# Altium schematic sheet microcontroller.SchDoc
size A4; Date: 21 Jul 2025; CompanyName: Abdullah; Engineer: Abdullah; Revision: 2; SheetNumber: 3; SheetTotal: 4
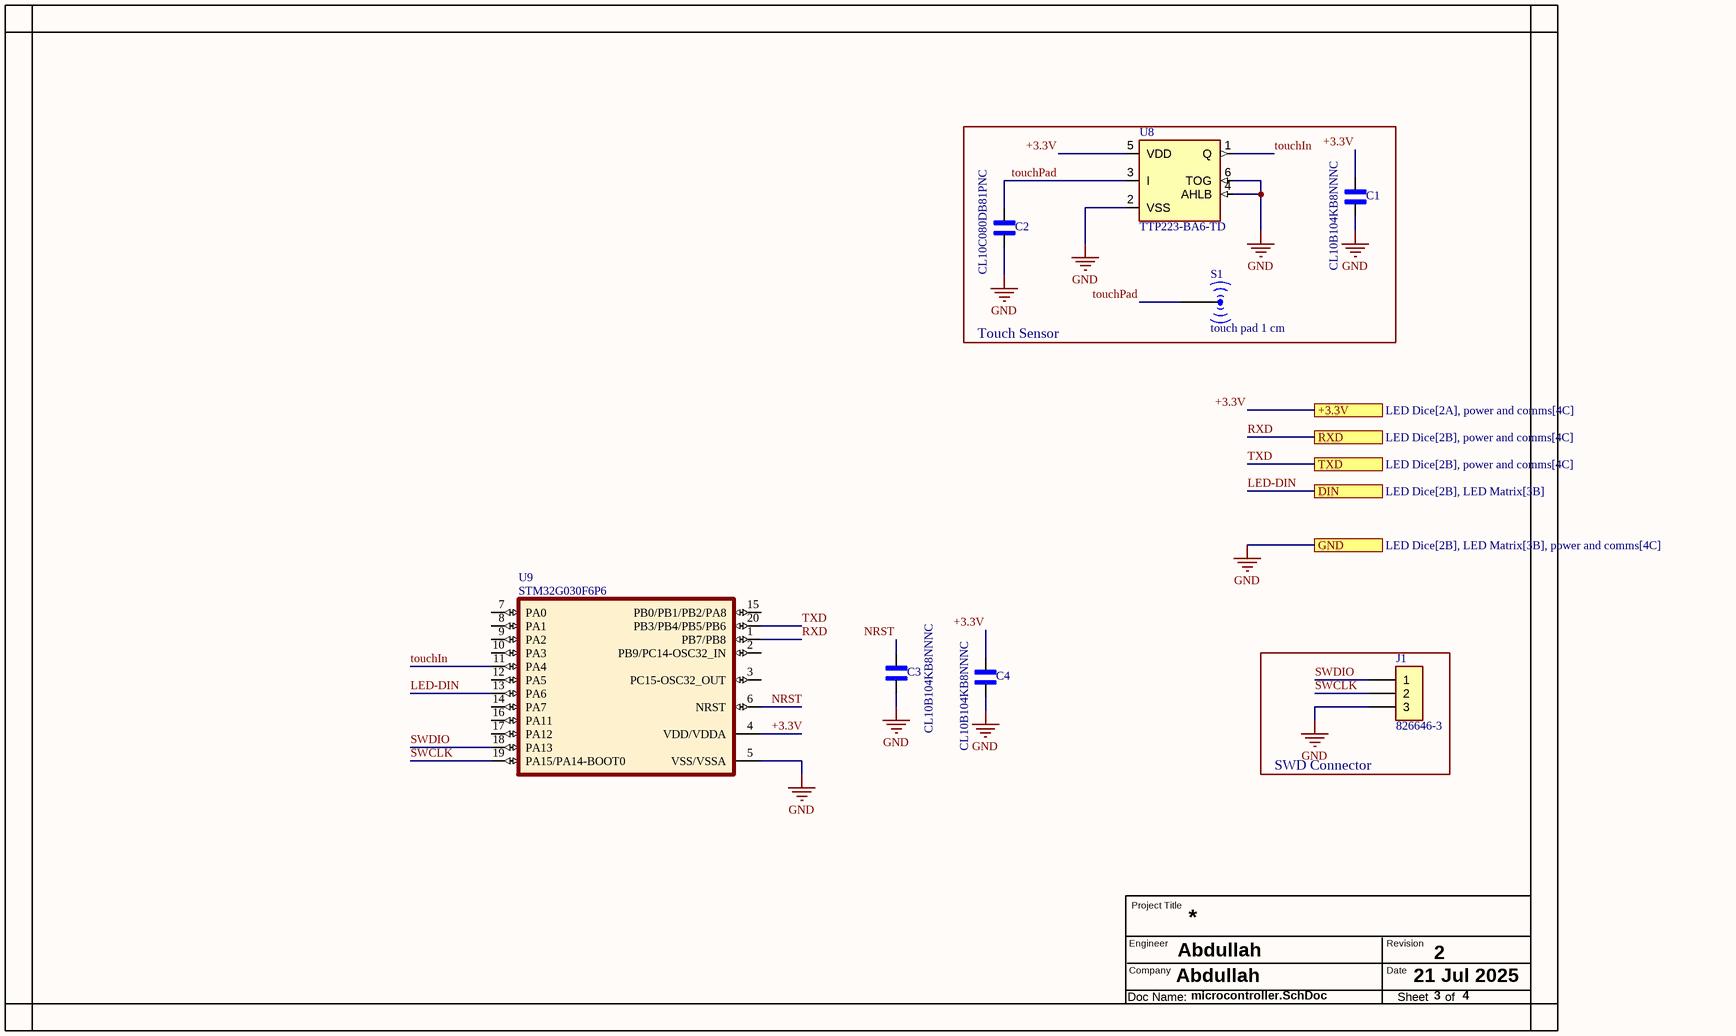
[diagram p0: microcontroller.SchDoc]

## Parts
C1  CL10B104KB8NNNC  [CAPC1608X90N]
C2  CL10C080DB81PNC  [CAPC1608X90N]
C3  CL10B104KB8NNNC  [CAPC1608X90N]
C4  CL10B104KB8NNNC  [CAPC1608X90N]
J1  826646-3  [TE_826646-3]
S1  touch pad 1 cm  [touch pad 1 cm]
U8  TTP223-BA6-TD  [SOT23-6]
U9  STM32G030F6P6  [*TSSOP20]

## Blocks framed on the sheet
Touch Sensor: C1 C2 S1 U8
SWD Connector: J1

## Ports
+3.3V (see LED Dice[2A], power and comms[4C]), DIN (see LED Dice[2B], LED Matrix[3B]), GND (see LED Dice[2B], LED Matrix[3B], power and comms[4C]), RXD (see LED Dice[2B], power and comms[4C]), TXD (see LED Dice[2B], power and comms[4C])

## Nets
GND: C1.1 C2.1 C3.1 C4.1 J1.3 U8.2(VSS) U8.4(AHLB) U8.6(TOG) U9.5(VSS/VSSA) ; port GND
+3.3V: C1.2 C4.2 U8.5(VDD) U9.4(VDD/VDDA) ; port +3.3V
LED-DIN: U9.13(PA6) ; port DIN
NRST: C3.2 U9.6(NRST)
RXD: U9.1(PB7/PB8) ; port RXD
SWCLK: J1.2 U9.19(PA15/PA14-BOOT0)
SWDIO: J1.1 U9.18(PA13)
touchIn: U8.1(Q) U9.11(PA4)
touchPad: C2.2 S1.1(in) U8.3(I)
TXD: U9.20(PB3/PB4/PB5/PB6) ; port TXD

Not connected (* = marked no-connect by the designer): U9 2(PB9/PC14-OSC32_IN) 3(PC15-OSC32_OUT) 7(PA0) 8(PA1) 9(PA2) 10(PA3) 12(PA5) 14(PA7) 15(PB0/PB1/PB2/PA8) 16(PA11) 17(PA12)

## Notes on the sheet
- Project Title
- Engineer
- Company
- Revision
- Date
- Doc Name:
- Sheet
- of

## Library data of the parts
C1 C3 C4 = CL10B104KB8NNNC: 0.1ÂµF Â±10% 50V Ceramic Capacitor X7R 0603 _1608 Metric_; MF: Samsung Electro-Mechanics; Price: None; MP: CL10B104KB8NNNC; SnapEDA_Link: https://www.snapeda.com/parts/CL10B104KB8NNNC/Samsung%20Electro-Mechanics/view-part/3598309/?ref=snap; Availability: Unavailable; Package: 0603 Samsung; Value: *
C2 = CL10C080DB81PNC: 50V 8pF C0G 0603 Multilayer Ceramic Capacitors MLCC - SMD/SMT ROHS; MP: GRM0335C1E8R0CA01D; Package: None; Price: None; Value: *; Availability: Unavailable
J1 = 826646-3: Connector Header Through Hole 3 position 0.100 (2.54mm); MF: TE Connectivity; SnapEDA_Link: https://www.snapeda.com/parts/826646-3/TE%20Connectivity%20AMP%20Connectors/view-part/2389612/?ref=snap; Mouser-Purchase-URL: https://snapeda.com/shop?store=Mouser&id=2389612; Availability: Good; DigiKey-Purchase-URL: https://snapeda.com/shop?store=DigiKey&id=2389612; MP: 826646-3; Package: None; Value: *; Price: None; EU_RoHS_Compliance: Compliant; Arrow_Europe-Purchase-URL: https://snapeda.com/shop?store=Arrow+Europe&id=2389612
S1 = touch pad 1 cm: Touch pad circular 1 cm
U8 = TTP223-BA6-TD: 1 key touchpad detector IC; MF: tontek; Value: *; SnapEDA_Link: https://www.snapeda.com/parts/TTP223-BA6/TONTEK/view-part/?ref=snap; Price: None; Availability: Not in stock; Package: None; MP: TTP223-BA6; Check_prices: https://www.snapeda.com/parts/TTP223-BA6/TONTEK/view-part/?ref=eda
U9 = STM32G030F6P6: ARMÂ® CortexÂ®-M0+ STM32G0 Microcontroller IC 32-Bit Single-Core 64MHz 32KB (32K x 8) FLASH 20-TSSOP; MF: STMicroelectronics; SnapEDA_Link: https://www.snapeda.com/parts/STM32G030F6P6/STMicroelectronics/view-part/?ref=snap; Package: TSSOP-20 STMicroelectronics; MP: STM32G030F6P6; Check_prices: https://www.snapeda.com/parts/STM32G030F6P6/STMicroelectronics/view-part/?ref=eda; Value: *